# Altium schematic sheet 红外感应开关.SchDoc
size A4
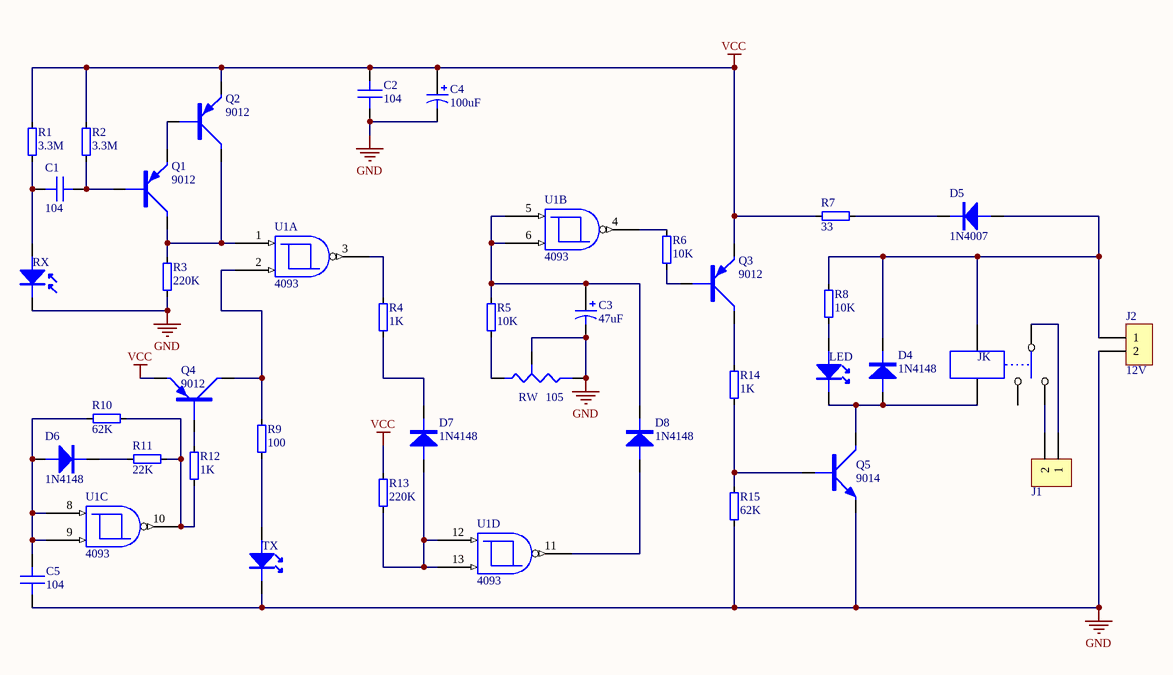
[diagram p0: 红外感应开关.SchDoc]

## Parts
C1  CAP  [104独石电容]  (value not drawn)
C2  CAP  [104独石电容]  (value not drawn)
C3  value 47uF  [47uf]  (hidden comment: Cap Pol1)
C4  value 100uF  [电容D=8mm]  (hidden comment: Cap Pol1)
C5  CAP  [104独石电容]  (value not drawn)
D4  1N4148  [1N4007]
D5  1N4007  [1N4007]
D6  1N4148  [1N4148]
D7  1N4148  [1N4148]
D8  1N4148  [1N4148]
J1  CON2  [KF-5.08]  (value not drawn)
J2  12V  [KF-5.08]
JK  RWLAY-SPDT  [继电器]  (value not drawn)
LED  FA  [DIODE]  (value not drawn)
Q1  9012  [8050-TO-92]
Q2  9012  [8050-TO-92]
Q3  9012  [8050-TO-92]
Q4  9012  [8050-TO-92]
Q5  9014  [8050-TO-92]
R1  RES  [RES-0.25W]  (value not drawn)
R2  RES  [RES-0.25W]  (value not drawn)
R3  RES  [RES-0.25W]  (value not drawn)
R4  RES  [RES-0.25W]  (value not drawn)
R5  RES  [RES-0.25W]  (value not drawn)
R6  RES  [RES-0.25W]  (value not drawn)
R7  RES  [RES-1W]  (value not drawn)
R8  RES  [RES-0.25W]  (value not drawn)
R9  RES  [RES-1W]  (value not drawn)
R10  RES  [RES-0.25W]  (value not drawn)
R11  RES  [RES-0.25W]  (value not drawn)
R12  RES  [RES-0.25W]  (value not drawn)
R13  RES  [RES-0.25W]  (value not drawn)
R14  RES  [RES-0.25W]  (value not drawn)
R15  RES  [RES-0.25W]  (value not drawn)
RW  RESISTOR TAPPED  [RVR-2]  (value not drawn)
RX  SHOU  [红外接受管]  (value not drawn)
TX  FA  [DIODE0.1]  (value not drawn)
U1  4093  [DIP-14]  (parts A,B,C,D of 4)

## Nets
GND: C2.2 C3.2 C4.2 C5.2 J2.2 Q5.1(E) R3.2 R15.2 RW.2 RW.3 RX.2 TX.2 U1.7(GND)
VCC: C2.1 C4.1 Q2.1(E) Q3.1(E) Q4.1(E) R1.1 R2.1 R7.1 R13.1 U1.14(VCC)
NetC1_1: C1.1 Q1.2(B) R2.2
NetC1_2: C1.2 R1.2 RX.1
NetC3_1: C3.1 D8.2 R5.1 U1.5 U1.6
NetC5_1: C5.1 D6.1 R10.1 U1.8 U1.9
NetD4_1: D4.1 JK.5 LED.2 Q5.3(C)
NetD4_2: D4.2 D5.1 J2.1 JK.4 R8.1
NetD5_2: D5.2 R7.2
NetD6_2: D6.2 R11.1
NetD7_1: D7.1 R13.2 U1.12 U1.13
NetD7_2: D7.2 R4.2
NetD8_1: D8.1 U1.11
NetJ1_1: J1.1 JK.1
NetJ1_2: J1.2 JK.2
NetLED_1: LED.1 R8.2
NetQ1_1: Q1.1(E) Q2.2(B)
NetQ1_3: Q1.3(C) Q2.3(C) R3.1 U1.1
NetQ3_2: Q3.2(B) R6.2
NetQ3_3: Q3.3(C) R14.1
NetQ4_2: Q4.2(B) R12.1
NetQ4_3: Q4.3(C) R9.1 U1.2
NetQ5_2: Q5.2(B) R14.2 R15.1
NetR4_1: R4.1 U1.3
NetR5_2: R5.2 RW.1
NetR6_1: R6.1 U1.4
NetR9_2: R9.2 TX.1
NetR10_2: R10.2 R11.2 R12.2 U1.10

Not connected (* = marked no-connect by the designer): JK 3

## Notes on the sheet
- (in symbol CAP) 104
- (in symbol RES) 3.3M; 220K; 1K; 22K; 62K; 100; 10K; 33
- (in symbol RESISTOR TAPPED) 105

## Library data of the parts
C1 C2 C5 = CAP: Capacitor，电容
C3 C4 = Cap Pol1: Polarized Capacitor (Radial); Published: 8-Jun-2000; LatestRevisionDate: 17-Jul-2002; LatestRevisionNote: Re-released for DXP Platform.; PackageReference: RB7.6-15; Publisher: Altium Limited
D4-D8 = DIODE
J1 J2 = CON2: Connector
LED TX = LED
Q1-Q4 = 9012: PNP Transistor
Q5 = 9014: NPN Transistor
RX = PHOTO: Photosensitive Diode